# Altium schematic sheet JTAG_POGOPIN_REV_A.SchDoc: FFT Progrmmer pins
size 210 x 147 mm; Author: Artis Kirsteins; Organization: FFT; Address1: Tukums; Address2: Latvia; Revision: A; SheetNumber: 1; SheetTotal: 1; ID: JTAG
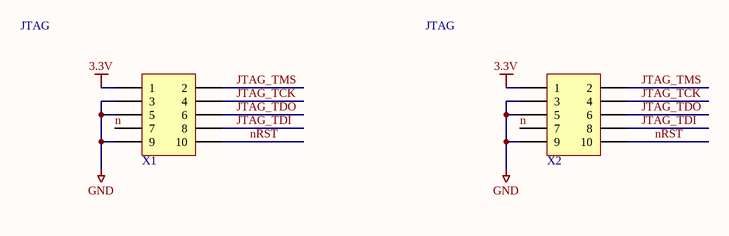
[diagram p0: JTAG_POGOPIN_REV_A.SchDoc]

## Parts
X1  FCI male 2x5  [FCI header M2x5]  (value not drawn)
X2  FCI male 2x5  [FCI header M2x5]  (value not drawn)

## Nets
3.3V: X1.1 X2.1
GND: X1.3 X1.5 X1.9 X2.3 X2.5 X2.9
JTAG_TCK: X1.4 X2.4
JTAG_TDI: X1.8 X2.8
JTAG_TDO: X1.6 X2.6
JTAG_TMS: X1.2 X2.2
n: X1.7 X2.7
nRST: X1.10 X2.10

## Notes on the sheet
- JTAG
- Title:
- ID:
- Date:
- Time:
- Revision:
- Tukums
- FFT
- Latvia
- Artis Kirsteins
- File:

## Library data of the parts
X1 X2 = FCI male 2x5: Part Description: 10 pin SMD straight pin header 1.27mm pich; Part Number: 20021121-00010C4LF; PartFootprint: SMD; Manufacturer: FCI; Temperature: -40÷85°C; MSD level: *; Packing: *; Tape width: *